# EAGLE design Wifinfo (EAGLE 7.3.0)
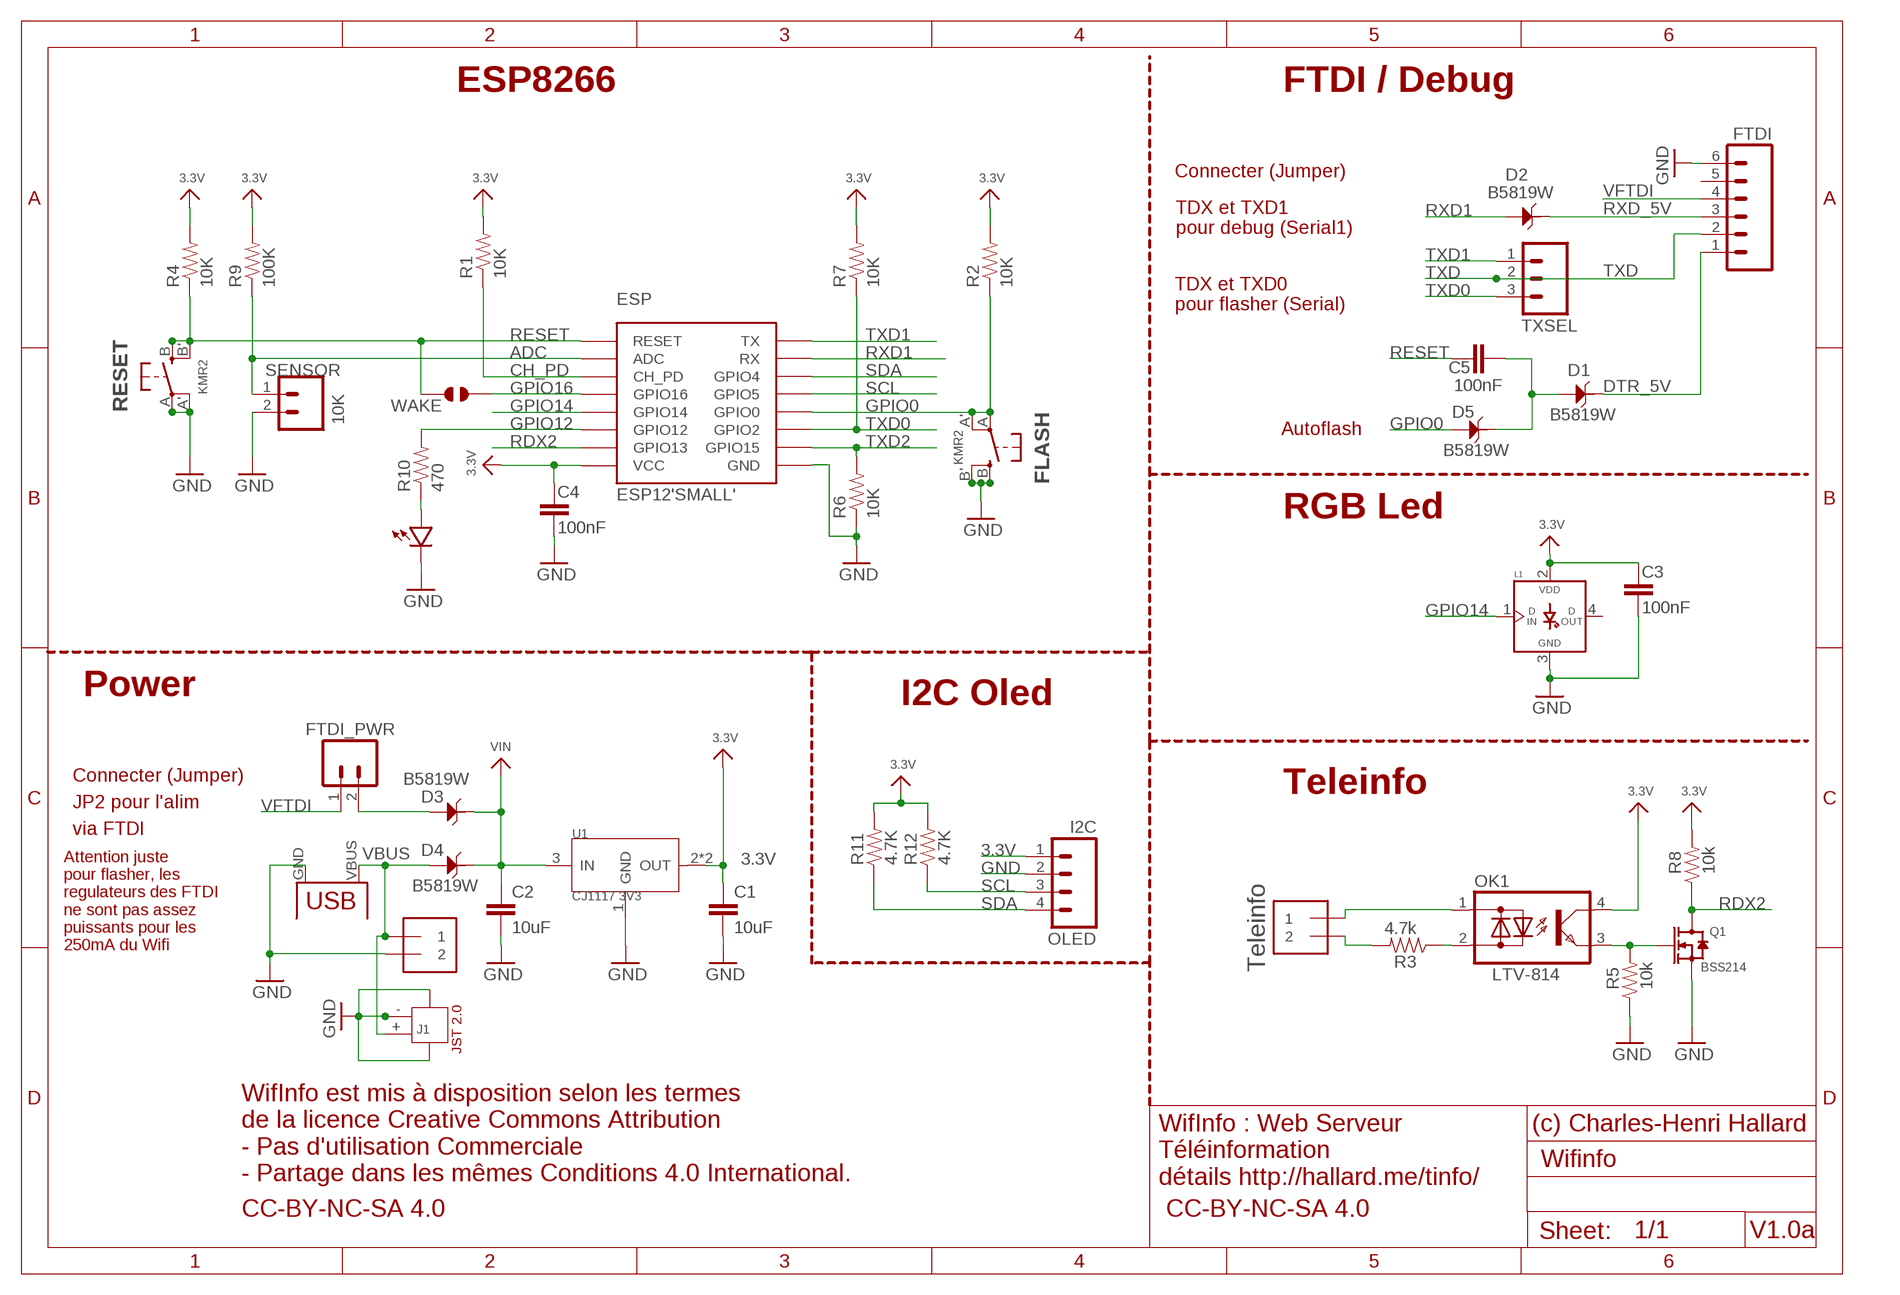
[diagram p0: schematic, sheet 1]

## Parts
C1  10uF  CAP0805-CAP  [0805-CAP]
C2  10uF  CAP0805-CAP  [0805-CAP]
C3  100nF  CAP0603-CAP  [0603-CAP]
C4  100nF  CAP0603-CAP  [0603-CAP]
C5  100nF  CAP0603-CAP  [0603-CAP]
D1  B5819W  D-ESD-2P-CESD5V0D1  [SOD123-2.7X1.6]
D2  B5819W  D-ESD-2P-CESD5V0D1  [SOD123-2.7X1.6]
D3  B5819W  D-ESD-2P-CESD5V0D1  [SOD123-2.7X1.6]
D4  B5819W  D-ESD-2P-CESD5V0D1  [SOD123-2.7X1.6]
D5  B5819W  D-ESD-2P-CESD5V0D1  [SOD123-2.7X1.6]
ESP  ESP12'SMALL'  [ESP08]
FLASH  KMR2  SWITCH_TACT_SMT4.6X2.8  [BTN_KMR2_4.6X2.8]
FTDI  M06SIP_LOCK_NO_SILK  [1X06-SIP_LOCK_NOSILK]
FTDI_PWR  M02LOCK  [1X02_LOCK]
J1  JST-2P-SMD'2.0'  [2P-SMD-2.0-90D]
L1  WS2812B  WS2812B5MM  [WS2812-PTH]
LED  RED  LED0603  [0603-LED]
OK1  LTV-814  SFH6206  [DIL4-SMD]
OLED  I2C  M04LOCK  [1X04_LOCK]
PWR  1X2-3.5MM  [1X2-3.5MM]
Q1  BSS214  MOSFET-N-''  [SOT23]
R1  10K  RESISTOR0603-RES  [0603-RES]
R2  10K  RESISTOR0603-RES  [0603-RES]
R3  4.7k  RESISTOR0603-RES  [0603-RES]
R4  10K  RESISTOR0603-RES  [0603-RES]
R5  10k  RESISTOR0603-RES  [0603-RES]
R6  10K  RESISTOR0603-RES  [0603-RES]
R7  10K  RESISTOR0603-RES  [0603-RES]
R8  10k  RESISTOR0603-RES  [0603-RES]
R9  100K  RESISTOR0805-RES  [0805-RES]
R10  470  RESISTOR0603-RES  [0603-RES]
R11  4.7K  RESISTOR0603-RES  [0603-RES]
R12  4.7K  RESISTOR0603-RES  [0603-RES]
RESET  KMR2  SWITCH_TACT_SMT4.6X2.8  [BTN_KMR2_4.6X2.8]
SENSOR  10K  M02PTH  [1X02]
TINFO  1X2-3.5MM  [1X2-3.5MM]
TXSEL  M03LOCK  [1X03_LOCK]
U1  CJ1117 3V3  CJ1117-3.3-1310120P1  [SOT89]
USB  USB  USB_POWER  [USB_MINIB_POWER]
WAKE  JUMPER_SOLDER_1X2  [JUMPER_SOLDER_1X2]

## Nets
3.3V: C1.1 C3.2 C4.2 ESP.VCC L1.2(VDD) OK1.4(C) OLED.1 R1.2 R2.2 R4.2 R7.2 R8.2 R9.2 R11.2 R12.2 U1.2(OUT) U1.4(OUT)
ADC: ESP.ADC R9.1 SENSOR.1
CH_PD: ESP.CH_PD R1.1
DTR_5V: D1.2 FTDI.1
GND: C1.2 C2.2 C3.1 C4.1 ESP.GND FLASH.B'(S1) FLASH.B(S) FTDI.6 J1.3 J1.4 J1.- L1.3(GND) LED.MINUS OLED.2 PWR.2 Q1.2(S) R5.1 R6.1 RESET.A'(P1) RESET.A(P) SENSOR.2 U1.1(GND) USB.GND
GPIO0: D5.1 ESP.GPIO0 FLASH.A'(P1) FLASH.A(P) R2.1
GPIO12: ESP.GPIO12 R10.2
GPIO14: ESP.GPIO14 L1.1(DIN)
GPIO16: ESP.GPIO16 WAKE.2
N$1: OK1.3(E) Q1.1(G) R5.2
N$2: D3.1 FTDI_PWR.2
N$3: OK1.2(AC2) R3.1
N$4: OK1.1(AC1) TINFO.1
N$5: R3.2 TINFO.2
N$6: LED.PLUS R10.1
N$7: C5.1 D1.1 D5.2
RDX2: ESP.GPIO13 Q1.3(D) R8.1
RESET: C5.2 ESP.RESET R4.1 RESET.B'(S1) RESET.B(S) WAKE.1
RXD1: D2.1 ESP.RX
RXD_5V: D2.2 FTDI.3
SCL: ESP.GPIO5 OLED.3 R12.1
SDA: ESP.GPIO4 OLED.4 R11.1
TXD: FTDI.2 TXSEL.2
TXD0: ESP.GPIO2 R7.1 TXSEL.3
TXD1: ESP.TX TXSEL.1
TXD2: ESP.GPIO15 R6.2
VBUS: D4.1 J1.+ PWR.1 USB.VBUS(VCC)
VFTDI: FTDI.4 FTDI_PWR.1
VIN: C2.1 D3.2 D4.2 U1.3(IN)
Unconnected: FTDI.5 L1.4(DOUT)

## Notes on the sheet
- ESP8266 | FTDI / Debug
- Connecter (Jumper)
- TDX et TXD1
  pour debug (Serial1)
- TDX et TXD0
  pour flasher (Serial)
- Autoflash
- RGB Led
- Power | I2C Oled
- Connecter (Jumper)
- Teleinfo
- JP2 pour l'alim
- via FTDI
- Attention juste
  pour flasher, les
  regulateurs des FTDI
  ne sont pas assez
  puissants pour les
  250mA du Wifi
- Teleinfo
- JST 2.0
- (c) Charles-Henri Hallard
- WifInfo est mis à disposition selon les termes
  de la licence Creative Commons Attribution
  - Pas d'utilisation Commerciale 
  - Partage dans les mêmes Conditions 4.0 International.
- WifInfo : Web Serveur
  Téléinformation
  détails http://hallard.me/tinfo/
- CC-BY-NC-SA 4.0 | CC-BY-NC-SA 4.0
- V1.0a

## Library data of the parts
C1-C5 = _c2h:CAP: Capacitor Standard 0603 ceramic capacitor, and 0.1" leaded capacitor.
D1-D5 = Seeed-Discrete:D-ESD-2P: Diodes for Protectiong against ESD
ESP = esp8266modules:ESP12: ESP8266 Wifi module 12
FLASH RESET = microbuilder:SWITCH_TACT_SMT: SMT Tact Switches 6x6mm - Digikey: P12940SCT-ND KMR2 (4.6x2.8mm) - Digikey: 401-1426-1-ND EVQ-PQHB55 - Light Touch, 160GF (4.5x4.5mm) - Digikey: P8090SCT-ND KMT0 - KMT021 NGJ LHS (etc.) IP68/Waterproof - Digikey: CKN10289CT-ND
FTDI = JeeLabs.rpt:M06: Header 6 Standard 6-pin 0.1" header. Use with straight break away headers (SKU : PRT-00116), right angle break away headers (PRT-00553), swiss pins (PRT-00743), machine pins (PRT-00117), and female headers (PRT-00115). Molex polarized connector foot print use with SKU : PRT-08094 with associated crimp pins and housings. NOTES ON THE VARIANTS LOCK and LOCK_LONGPADS... This footprint was designed to help hold the alignment of a through-hole component (i.e. 6-pin header) while soldering it into place. You may notice that each hole has been shifted either up or down by 0.005 of an inch from it's more standard position (which is a perfectly straight line). This slight alteration caused the pins (the squares in the middle) to touch the edges of the holes. Because they are alternating, it causes a "brace" to hold the component in place. 0.005 has proven to be the perfect amount of "off-center" position when using our standard breakaway headers. Although looks a little odd when you look at the bare footprint, once you have a header in there, the alteration is very hard to notice. Also, if you push a header all the way into place, it is covered up entirely on the bottom side. This idea of altering the position of holes to aid alignment will be further integrated into the Sparkfun Library for other footprints. It can help hold any component with 3 or more connection pins.
FTDI_PWR SENSOR = SparkFun-Connectors:M02: Standard 2-pin 0.1" header. Use with - straight break away headers ( PRT-00116) - right angle break away headers (PRT-00553) - swiss pins (PRT-00743) - machine pins (PRT-00117) - female headers (PRT-00115) Molex polarized connector foot print use with: PRT-08233 with associated crimp pins and housings. 2.54_SCREWTERM for use with PRT-10571. 3.5mm Screw Terminal footprints for PRT-08084 5mm Screw Terminal footprints for use with PRT-08432
J1 = Seeed-Connector:JST-2P-SMD: 2P-SMD-2.0-90D:320110026
L1 = _c2h:WS2812B
LED = _c2h:LED
OK1 = optocoupler:SFH620: Optocoupler, Phototransistor Output, AC Input Source: http://www.vishay.com/docs/83675/sfh620.pdf; MF: VISHAY/TELEFUNKEN; MPN: SFH6206-3; OC_FARNELL: 1469585; OC_NEWARK: 58K2214
OLED = SparkFun-Connectors:M04: Header 4 Standard 4-pin 0.1" header. Use with straight break away headers (SKU : PRT-00116), right angle break away headers (PRT-00553), swiss pins (PRT-00743), machine pins (PRT-00117), and female headers (PRT-00115). Molex polarized connector foot print use with SKU : PRT-08231 with associated crimp pins and housings. 1MM SMD Version SKU: PRT-10208
PWR TINFO = adafruit:1X2: 3.5mm Terminal block http://www.ladyada.net/library/pcb/eaglelibrary.html
Q1 = Seeed-Discrete:MOSFET-N: CJ2302：SMD MOSFET N-CH 20V-2.1A
R1-R12 = _c2h:RESISTOR: Resistor Basic schematic elements and footprints for 0603, 1206, and PTH resistors.
TXSEL = SparkFun-Connectors:M03: Header 3 Standard 3-pin 0.1" header. Use with straight break away headers (SKU : PRT-00116), right angle break away headers (PRT-00553), swiss pins (PRT-00743), machine pins (PRT-00117), and female headers (PRT-00115). Molex polarized connector foot print use with SKU : PRT-08232 with associated crimp pins and housings.
U1 = Seeed-IC:CJ1117-3.3: 1A Low Dropout Linear Regulator
USB = _c2h:USB_POWER
WAKE = dp_devices:JUMPER_SOLDER_1X2

## Net classes
1 power: width 0.305 mm

## Board
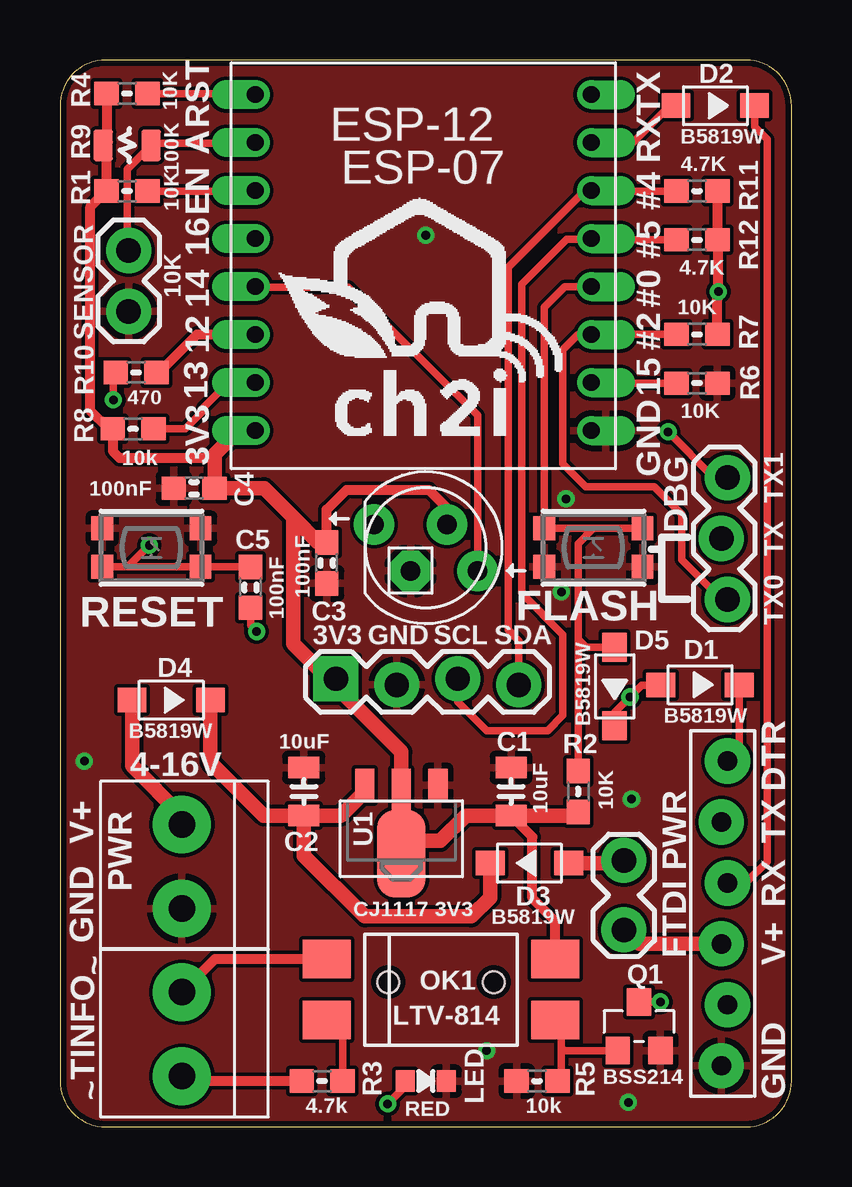
[diagram p1: board, top side]
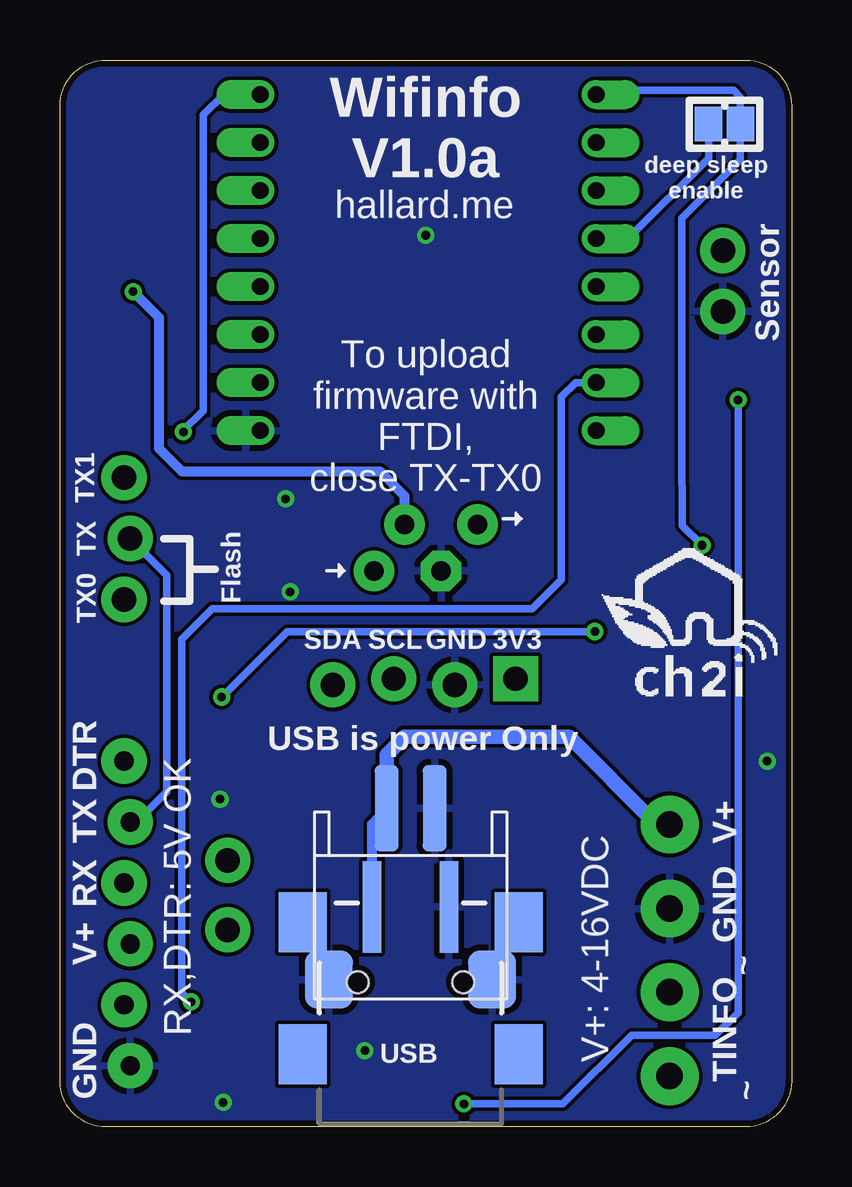
[diagram p2: board, bottom side, seen from below]

Size 30.48 x 44.45 mm. Coordinates in mm from the lower left corner, seen from the top.
Outline: 0,42.55 0,1.91 arc90 1.91,0 28.57,0 arc90 30.48,1.91 30.48,42.55 arc90 28.57,44.45 1.91,44.45 arc90 0,42.55
Copper layers (1*16): Top 0.035mm / dielectric 1.5mm / Bottom 0.035mm
Design rules "SeeedStudio_2layer_DRU_no_angle_20140221": minimum track width 6mil, minimum drill 12mil, track to track 6mil, track to pad 6mil, pad to pad 6mil, via to via 6mil, smd to smd 0mil, copper to edge 10mil, drill to drill 10mil, minimum pad ring 10mil, minimum via ring 6mil, stop-mask expansion 2mil, vias tented up to drill 100mil, thermal gap 10mil

### Footprints (pad centres in the part's own frame; a part is rotated, then mirrored left to right if it is on the bottom)
0805-CAP = smd 0.902 x 1.3: 1 -1,0; 2 1,0
0603-CAP = smd 1.016 x 0.965: 1 -0.85,0; 2 0.85,0
SOD123-2.7X1.6 = smd 1.2 x 1.02: 1 -1.635,0; 2 1.635,0
ESP08 = drill 0.7 offset: ADC -7.1,3.8; CH_PD -7.1,1.8; GND 6.9,-8.2; GPIO0 6.9,-2.2; GPIO2 6.9,-4.2; GPIO4 6.9,1.8; GPIO5 6.9,-0.2; GPIO12 -7.1,-4.2; GPIO13 -7.1,-6.2; GPIO14 -7.1,-2.2; GPIO15 6.9,-6.2; GPIO16 -7.1,-0.2; RESET -7.1,5.8; RX 6.9,3.8; TX 6.9,5.8; VCC -7.1,-8.2
BTN_KMR2_4.6X2.8 = smd 0.9 x 1: A 2.05,0.8; A' -2.05,0.8; B 2.05,-0.8; B' -2.05,-0.8
1X06-SIP_LOCK_NOSILK = drill 0.8 pad 1.88: 1 -6.35,0; 2 -3.81,-0.254; 3 -1.27,0; 4 1.27,-0.254; 5 3.81,0; 6 6.35,-0.254
1X02_LOCK = drill 1.016 pad 1.88: 1 -0.178,0; 2 2.718,0
2P-SMD-2.0-90D = smd 2 x 2.4: 3 3.4,-2.181; 4 -3.4,-2.181 | smd 1 x 3.6: + -1,4.953; - 1,4.953
WS2812-PTH = drill 0.8 pad 1.676: 1 2.159,-0.968; 2 0.889,0.968; 4 -2.159,0.968 | drill 0.8 pad 1.676 octagon: 3 -0.635,-0.968
0603-LED = smd 0.8 x 0.9: MINUS -0.85,0; PLUS 0.85,0
DIL4-SMD = smd 1.6 x 2: 1 -1.27,-4.77; 2 1.27,-4.77; 3 1.27,4.77; 4 -1.27,4.77
1X04_LOCK = drill 1.016 pad 1.88 square: 1 0,0.127 | drill 1.016 pad 1.88: 2 2.54,-0.127; 3 5.08,0.127; 4 7.62,-0.127
1X2-3.5MM = drill 1.1 pad 2.413: 1 1.8,0; 2 -1.7,0
SOT23 = smd 1.016 x 1.143: 1 -0.889,-1.016; 2 0.889,-1.016; 3 0,1.016
0603-RES = smd 1.016 x 0.965: 1 -0.85,0; 2 0.85,0
0805-RES = smd 0.8 x 1.3: 1 -1,0; 2 1,0
1X02 = drill 1.016 pad 1.88: 1 0,0; 2 2.54,0
1X03_LOCK = drill 1.016 pad 1.88: 1 0,0.127; 2 2.54,-0.127; 3 5.08,0.127
SOT89 = smd 0.8 x 1.4: 1 -1.524,-1.905; 3 1.524,-1.905 | smd 0.8 x 1.9: 2 0,-1.651 | smd 2.032 x 3.65: 4 0,0.94
USB_MINIB_POWER = smd 3.81 x 0.762: GND 4.405,-1.6; VBUS 4.405,1.6 | smd 2.5 x 2: GND@1 -1.73,-4.5; GND@2 -1.73,4.5; GND@3 3.77,4.5; GND@4 3.77,-4.5 | hole 0.9: 1.27,2.2; 1.27,-2.2
JUMPER_SOLDER_1X2 = smd 1.143 x 1.422: 1 -0.66,0; 2 0.66,0

### Placement (x,y rotation side)
C1  18.8,13.97 90 top
C2  10.16,13.97 90 top
C3  11.11,23.5 90 top
C4  5.59,26.61 0 top
C5  7.94,22.48 90 top
D1  26.67,18.41 0 top
D2  27.3,42.55 0 top
D3  19.56,10.99 180 top
D4  4.64,17.78 0 top
D5  23.11,18.35 270 top
ESP  15.24,37.21 0 top
FLASH  22.23,24.13 0 top
FTDI  27.81,8.89 270 top
FTDI_PWR  23.5,8.38 90 top
J1  15.88,8.32 0 bottom
L1  15.24,24.13 0 top
LED  15.24,1.91 180 top
OK1  15.88,5.71 270 top
OLED  11.49,18.54 0 top
PWR  5.08,10.79 90 top
Q1  24.13,4.19 0 top
R1  2.79,38.99 180 top
R2  21.59,13.97 270 top
R3  10.92,1.91 180 top
R4  2.79,43.05 180 top
R5  19.88,1.91 0 top
R6  26.54,30.99 180 top
R7  26.54,33.02 0 top
R8  3.05,29.08 180 top
R9  2.79,40.89 180 top
R10  3.17,31.43 0 top
R11  26.54,38.99 0 top
R12  26.54,36.96 0 top
RESET  3.81,24.13 0 top
SENSOR  2.86,36.51 270 top
TINFO  5.08,3.81 90 top
TXSEL  27.69,27.05 270 top
U1  14.22,12.32 180 top
U$11  [LOGO_CH2I_110MM]  15.62,31.75 0 top
U$12  [LOGO_CH2I_75MM]  8,17.91 0 bottom
USB  15.88,4.76 90 bottom
WAKE  2.79,41.78 180 bottom

### Tracks (layer width: path | path; a pad name or v marks a point on that pad's centre or on a via)
3.3V  (via drill 0.36 pad 0.71)
  Top 0.305: R9.2 2.05,41.02 1.79,40.77 | R7.2 27.56,33.02 | ESP.VCC 8.2,28.96
  Top 0.406: OK1.4 20.64,8.56 19.68,9.53 19.68,12.08 C1.1 | 14.76,11.91 U1.4 | R4.2 1.94,41.04 R9.2 1.94,40.74 R1.2 1.92,38.99 1.27,38.34 1.27,29.84 2.03,29.08 R8.2 2.2,28.16 2.48,27.88 6.29,27.88 6.67,28.26 | R11.2 R12.2 27.43,36.92 v27.43,34.8 27.39,34.51 R7.2 | L1.2 16.13,25.78 15.37,26.54 11.94,26.54 11.11,25.72 C3.2
  Top 0.61: R2.2 21.44,12.97 C1.1 16.91,12.97 15.85,11.91 14.76,11.91 14.22,12.45 U1.2 14.22,15.62 11.49,18.35 OLED.1 11.18,18.67 9.72,20.13 9.72,25.4 | 9.72,25.4 8.51,26.61 C4.2 6.44,28.03 6.67,28.26 7.37,28.96 8.2,28.96 | C3.2 10.77,24.34 9.72,25.4
  Bottom 0.406: v27.43,34.8 26.35,33.72 26.35,28.26 25.4,27.3 17.14,27.3 16.13,26.29 L1.2
ADC
  Top 0.254: 8.14,40.98 ESP.ADC
  Top 0.305: SENSOR.1 2.79,36.83 2.79,39.89 R9.1 4.26,40.98 8.14,40.98
CH_PD
  Top 0.254: 8.14,38.99 ESP.CH_PD
  Top 0.305: 8.14,38.99 R1.1
DTR_5V
  Top 0.305: D1.2 28.3,15.73 FTDI.1
GND  (via drill 0.36 pad 0.71)
  other vias: 15.24,37.15 23.81,13.65 17.78,3.17 23.69,1.02 1.02,15.24 21.08,26.16 20.89,22.29
  pour Top: -0.64,-0.64 -0.64,45.21 31.11,45.21 31.11,-0.64
  pour Bottom: -1.27,-1.27 -1.27,45.85 31.75,45.85 31.75,-1.27
GPIO0
  Top 0.305: 22.23,24.93 FLASH.A' 20.18,34.15 21.04,35.01 ESP.GPIO0 | 22.23,24.93 FLASH.A | R2.1 21.59,20.32 | 21.59,20.32 21.59,24.3 22.23,24.93 | D5.1 21.92,19.99 21.59,20.32
GPIO12
  Top 0.406: R10.2 4.13,31.43 5.71,33.01 ESP.GPIO12
GPIO14
  Top 0.254: 8.14,34.98 ESP.GPIO14
  Top 0.305: L1.1 17.4,29.65 12.01,34.98 8.14,34.98
GPIO16
  Bottom 0.305: WAKE.2 3.45,40.36 6.79,37.02 ESP.GPIO16
N$1
  Top 0.305: OK1.3 20.7,4.45 | OK1.3 21.21,4.45 | 20.88,3.3 20.88,4.21 OK1.3 | Q1.1 21,3.17 20.88,3.3 | 20.88,3.3 20.88,2.06 R5.2
N$2
  Top 0.61: D3.1 23.42,10.99 FTDI_PWR.2
N$3
  Top 0.305: R3.1 11.77,3.78 OK1.2
N$4
  Top 0.406: OK1.1 6.46,6.99 TINFO.1
N$5
  Top 0.406: R3.2 5.29,1.91 TINFO.2
N$6  (via drill 0.36 pad 0.71)
  Top 0.305: LED.PLUS 14.24,1.54 v13.65,0.95 | v2.22,30.29 2.22,31.43 2.16,31.43 2.37,31.62 R10.1
  Bottom 0.305: v13.65,0.95 9.53,0.95 6.67,3.81 3.17,3.81 2.22,4.76 v2.22,30.29
N$7  (via drill 0.36 pad 0.71)
  Top 0.305: C5.1 7.94,20.89 v8.19,20.64 | 25.02,18.54 25.02,18.43 | 25.02,18.4 25.02,18.43 | 25.02,18.43 D1.1 25.02,18.4 | D5.2 23.11,17.27 v23.75,17.91 24.24,18.4 25.02,18.4
  Bottom 0.305: v8.19,20.64 21.02,20.64 v23.75,17.91
RDX2  (via drill 0.36 pad 0.71)
  Top 0.305: Q1.3 v25.02,5.21 | R8.1 5.21,29.08 5.97,29.84 5.97,29.96 6.99,30.98 8.14,30.98 ESP.GPIO13
  Bottom 0.305: v25.02,5.21 25.4,5.59 25.4,20.32 24.13,21.59 10.79,21.59 9.59,22.8 9.59,30.42 8.99,31.01 ESP.GPIO13
RESET  (via drill 0.36 pad 0.71)
  Top 0.305: RESET.B' 2.82,23.33 | v3.72,24.23 2.82,23.33 | 2.82,23.33 RESET.B C5.2 | R4.1 8.1,43.05 ESP.RESET
  Bottom 0.305: v3.72,24.23 4.55,25.04 4.57,28.45 4.57,37.85 2.13,40.28 WAKE.1 2.13,42.9 2.41,43.18 7.97,43.18 ESP.RESET 8.05,42.93
RXD1
  Top 0.305: ESP.RX 22.15,41.02 23.88,41.02 25.4,42.55 D2.1
RXD_5V
  Top 0.305: FTDI.3 28.57,10.16 29.46,11.05 29.46,41.15 28.94,41.67 D2.2
SCL
  Top 0.305: 22.17,36.98 21.11,36.98 19.24,35.12 19.24,22.23 20.95,20.51 20.95,17.14 20.32,16.51 17.78,16.51 16.57,17.72 OLED.3 | R12.1 22.19,36.96 22.17,36.98 | 22.17,36.98 ESP.GPIO5
SDA
  Top 0.305: R11.1 22.16,38.99 ESP.GPIO4 21.87,39.01 18.67,35.81 18.67,20.7 19.11,20.26 OLED.4
TXD
  Bottom 0.305: FTDI.2 27.3,12.7 26.04,13.97 26.04,22.99 TXSEL.2
TXD0
  Top 0.305: 25.54,32.98 R7.1 | TXSEL.3 27.56,21.97 25.91,23.62 25.91,25.53 24.77,26.67 21.91,26.67 20.95,27.62 20.95,32.38 21.58,33.01 ESP.GPIO2 R7.1 | 25.43,33.01 R7.1
TXD1  (via drill 0.36 pad 0.71)
  Top 0.305: TXSEL.1 27.24,27.05 v25.34,28.96
  Bottom 0.305: v25.34,28.96 25.4,28.96 24.51,29.84 24.51,42.16 23.66,43.01 ESP.TX
TXD2
  Top 0.305: R6.2 22.16,30.99 ESP.GPIO15
VBUS
  Top 0.61: D4.1 3,15.05 5.08,12.97 PWR.1
  Bottom 0.406: J1.+ 17.48,12.61 USB.VBUS
  Bottom 0.61: J1.+ 16.88,15.51 16.13,16.26 9.27,16.26 5.71,12.7 5.18,12.7 PWR.1
VFTDI
  Top 0.61: FTDI.4 24.13,7.62 FTDI_PWR.1
VIN
  Top 0.61: D3.2 17.92,9.54 17.14,8.76 12.7,8.76 10.16,11.3 C2.1 | D4.2 6.27,15.19 8.49,12.97 C2.1 | U1.3 12.7,13.97 11.7,12.97 C2.1

### Text on the board
tPlace: RST | TX | A | RX | ESP-07 | EN | #4 | 16 | #5 | 14 | #0 | 12 | #2 | 13 | 15 | 3V3 | GND | TX1 | DBG | TX | TX0 | 3V3 | GND | SCL | SDA | C1 | 4-16V | FTDI PWR | DTR | V+ | TX | GND | RX | ~ | V+ | ~ | GND
bPlace: Wifinfo / V1.0a | deep sleep / enable | hallard.me | Sensor | To upload / firmware with / FTDI, / close TX-TX0 | TX1 | TX | Flash | TX0 | 3V3 | GND | SCL | SDA | USB is power Only | DTR | V+ | TX | RX,DTR: 5V OK | GND | RX | ~ | V+: 4-16VDC | V+ | TINFO | ~ | GND